# Altium schematic sheet power supply.SchDoc: Power Supply
size 292 x 203 mm; DrawnBy: DMGB Nawarathna; DocumentNumber: -; SheetNumber: 3; SheetTotal: 4; Project: Product Sorter; DateDrawn: 4/4/2024
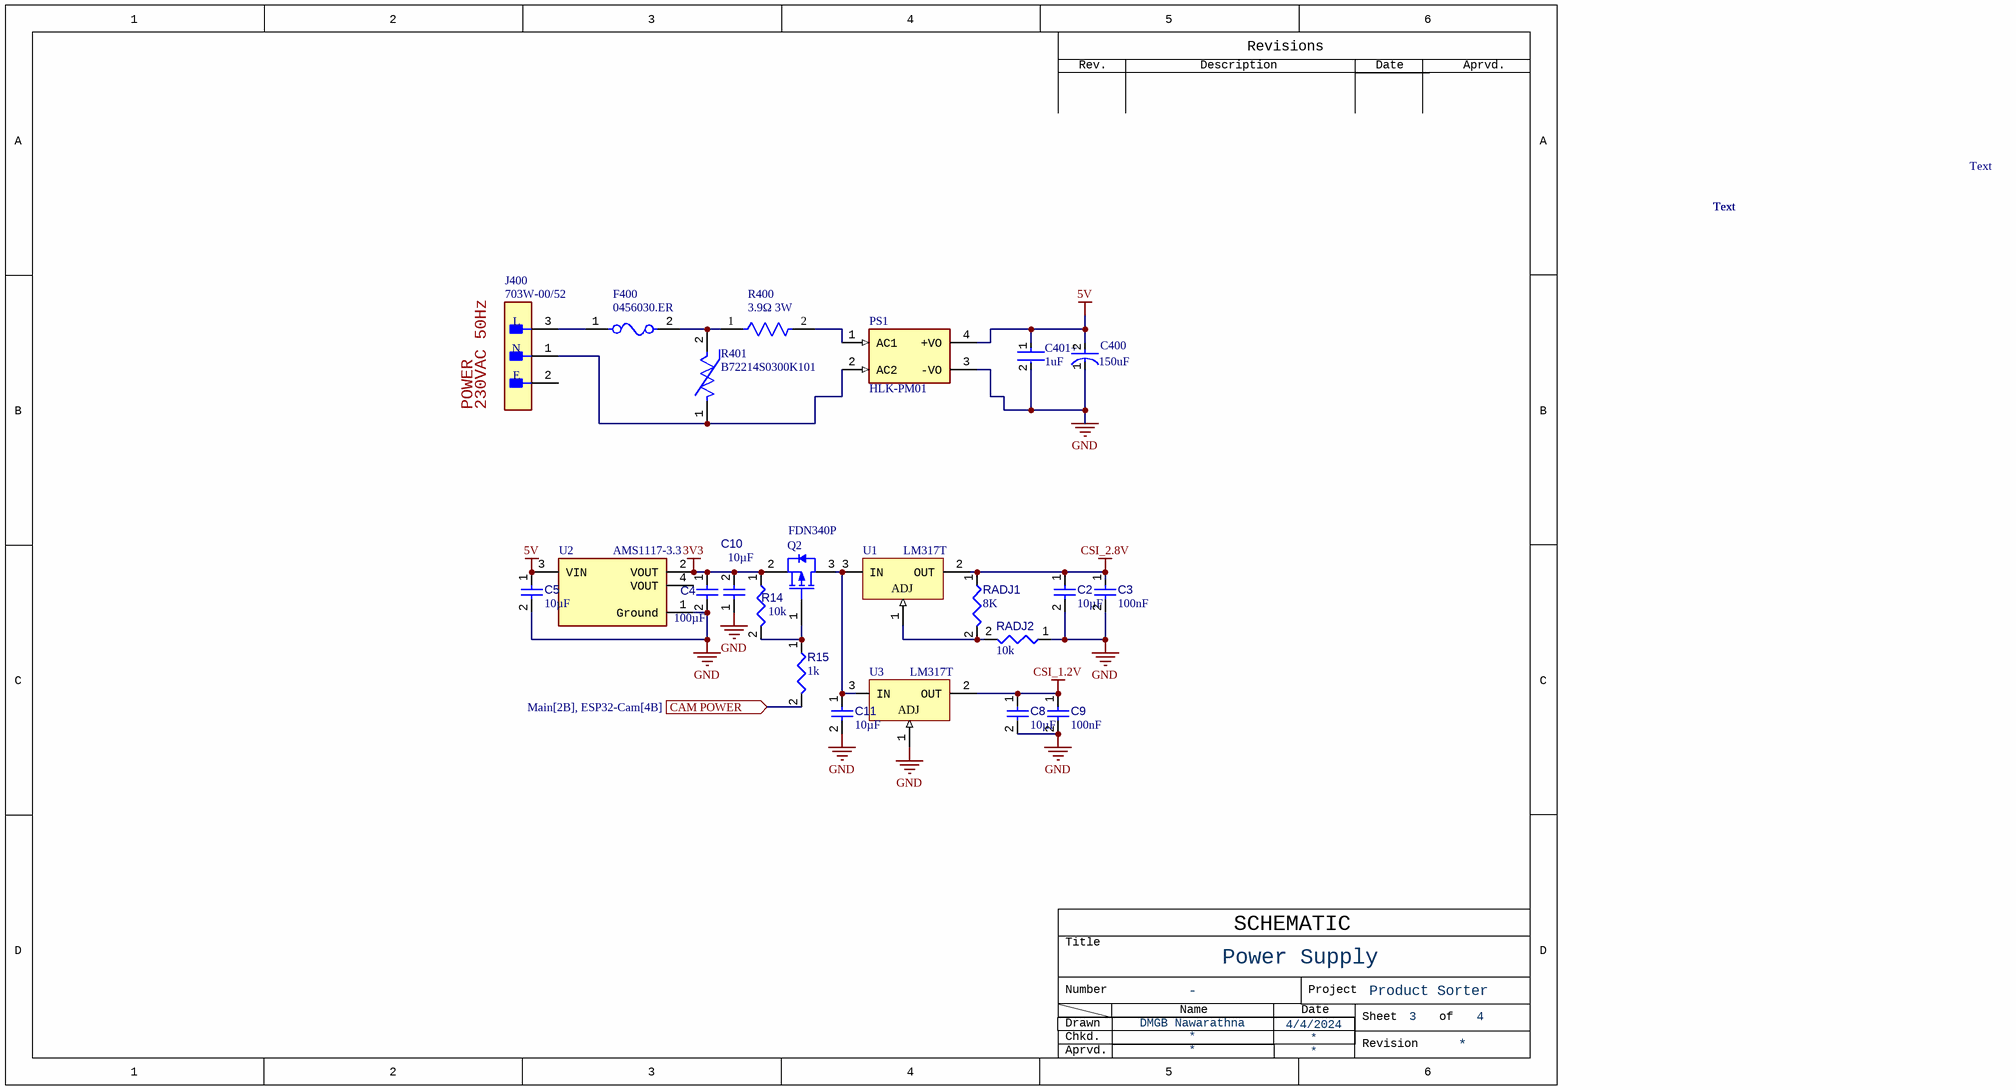
[diagram p0: power supply.SchDoc]

## Parts
C2  value 10µF  [CAPC0603(1608)100_L]  (hidden comment: Capacitor 10µF +/-20% 10V 0603)
C3  value 100nF  [CAPC1005X56X25LL10T15]  (hidden comment: Capacitor 0.1 uF +/- 5% 16 V 0402)
C4  value 100µF  [CAPC0805(2012)145_L]  (hidden comment: Capacitor 100µF +/-20% 6.3V 0805)
C5  value 10µF  [CAPC0603(1608)100_L]  (hidden comment: Capacitor 10µF +/-20% 10V 0603)
C8  value 10µF  [CAPC0603(1608)100_L]  (hidden comment: Capacitor 10µF +/-20% 10V 0603)
C9  value 100nF  [CAPC1005X56X25LL10T15]  (hidden comment: Capacitor 0.1 uF +/- 5% 16 V 0402)
C10  value 10µF  [CAPC0603(1608)100_L]  (hidden comment: Capacitor 10µF +/-20% 10V 0603)
C11  value 10µF  [CAPC0603(1608)100_L]  (hidden comment: Capacitor 10µF +/-20% 10V 0603)
C400  Capacitance: 150uF  [FP-FKD-MFG]  (hidden comment: EEE-FK1A151P)
C401  Capacitance: 1uF  [FP-1210-L_3_3_0_4-W_2_5_0-IPC_B]  (hidden comment: 12101C105KAZ2A)
F400  0456030.ER  [FP-0456-MFG]
J400  703W-00/52  [FP-703W-00-52-MFG]
PS1  HLK-PM01  [CONV_HLK-PM01]
Q2  FDN340P  [FAIR-SSOT3L-3_V]
R14  value 10k  [RESC2013X50X35ML15T15]  (hidden comment: Resistor 10k +/-1% 0805 125 mW)
R15  value 1k  [RESC0805(2012)_L]  (hidden comment: Resistor 1K +/-5% 0805 125 mW)
R400  Power Rating: 3W  Resistance: 3.9Ω  [FP-RWM0410-MFG]  (hidden comment: RWM04103R90JR15E1)
R401  B72214S0300K101  [FP-B72214S0300K101-MFG]
RADJ1  value 8K  [RESC0805(2012)_L]  (hidden comment: Resistor 1K +/-5% 0805 125 mW)
RADJ2  value 10k  [RESC2013X50X35ML15T15]  (hidden comment: Resistor 10k +/-1% 0805 125 mW)
U1  LM317T  [TO-220]
U2  AMS1117-3.3  [FP-AMS1117-IPC_C]
U3  LM317T  [TO-220]

## Ports
CAM POWER (in, see Main[2B], ESP32-Cam[4B])

## Nets
3V3: C4.1 C10.2 Q2.2(SOURCE) R14.1 U2.2(VOUT)
5V: C5.1 C400.2(A) C401.1 PS1.4(+VO) U2.3(VIN)
CSI_1.2V: C8.1 C9.1 U3.2(OUT)
CSI_2.8V: C2.1 C3.1 RADJ1.1 U1.2(OUT)
GND: C2.2 C3.2 C4.2 C5.2 C8.2 C9.2 C10.1 C11.2 C400.1(C) C401.2 PS1.3(-VO) RADJ2.1 U2.1(Ground) U3.1(ADJ)
CAM POWER: R15.2 ; port CAM POWER
NetC11_1: C11.1 Q2.3(DRAIN) U1.3(IN) U3.3(IN)
NetF400_1: F400.1 J400.3(L)
NetF400_2: F400.2 R400.1 R401.2
NetJ400_1: J400.1(N) PS1.2(AC2) R401.1
NetPS1_1: PS1.1(AC1) R400.2
NetQ2_1: Q2.1(GATE) R14.2 R15.1
NetRADJ1_2: RADJ1.2 RADJ2.2 U1.1(ADJ)

Not connected (* = marked no-connect by the designer): J400 2(E); U2 4(VOUT)

## Notes on the sheet
- Text
- POWER
- (near J400) 230VAC 50Hz
- Rev.
- Description
- Revisions
- Date
- Aprvd.
- Title
- SCHEMATIC
- Number
- Drawn
- Chkd.
- Name
- Project
- Sheet      of
- Revision
- (in symbol CMP-05427-002136-1) +

## Library data of the parts
C2 C5 C8 C10 C11 = CMP-001-00075-4: Chip Capacitor, 10µF +/-20%, 10V, 0603, Thickness 1 mm; Tolerance: 10%; Voltage Rating: 10V; Max Operating Temperature: 85°C; Pins: 2; Case/Package: 0603; Mounting Technology: SMT; Min Operating Temperature: -55°C
C3 C9 = CMP-001-00001-6: Chip Capacitor, 0.1 uF, +/- 5%, 16 V, 0402 (1005 Metric); Capacitor Type: Ceramic; Voltage Rating: 16V; Max Operating Temperature: 125°C; Min Operating Temperature: -55°C; Case/Package: 0402; Mounting Technology: SM; Pins: 2; Tolerance: 5%; RoHS Compliant: True
C4 = CMP-001-00054-4: Chip Capacitor, 100µF +/-20%, 6.3V, 0805, Thickness 1.45 mm; Tolerance: 10%; Min Operating Temperature: -55°C; Max Operating Temperature: 85°C; Pins: 2; Mounting Technology: SMT; Case/Package: 0805; Voltage Rating: 6.3V
C400 = CMP-05427-002136-1: CAP ALUM 150UF 20% 10V SMD; Impedance: 360mR; Ripple Current (AC): 240mA; Polarity: Polar; Life (Hours): 2000Hour; Leakage Current: 3uA; Lead Diameter: 0.65mm; Min Operating Temperature: -55°C; Lead Pitch: 1.8mm; Size: 5.8mm; Diameter: 6.3mm; Package Quantity: 1000; Number of Pins: 2; Termination: SMD/SMT; Mount: Surface Mount; Construction: Cylindrical; Series: FK; Case/Package: Radial; Lead Free: Lead Free; Voltage: 10V; Packaging: Tape and Reel; Height: 5.8mm; Max Operating Temperature: 105°C; Voltage Rating (DC): 10V; Reach SVHC Compliant: Yes; Width: 7.8mm; Tolerance: 20%; Contact Plating: Tin; Voltage Rating: 10V; Ratings: AEC-Q200; RoHS Compliant: Yes; Radiation Hardening: No; ESR (Equivalent Series Resistance): 360mR; Height - Seated (Max): 0.24inch; Length: 5.8mm; Ripple Current: 240mA
C401 = CMP-04427-007938-1: General Purpose Ceramic Capacitor, 1210, 1uF, 10%, X7R, 15%, 100V; Dissipation Factor: 2.5%; Package Quantity: 1; Contact Plating: Tin; Lead Free: Lead Free; Construction: Flat; Dielectric: X7R; Width: 2.5mm; Voltage Rating (DC): 100V; Case Code (Imperial): 1210; Case Code (Metric): 3225; Packaging: Tape and Reel; Min Operating Temperature: -55°C; Tolerance: 10%; Voltage: 100V; RoHS Compliant: Yes; Voltage Rating: 100V; Max Operating Temperature: 125°C; REACH SVHC: No SVHC; Features: Soft Termination; Height: 2.79mm; Termination: SMD/SMT; Thickness: 0.11inch; Case/Package: 1210; Length: 3.2mm; Series: FLEXITERM®; Dielectric Material: Ceramic; Mount: Surface Mount; Radiation Hardening: No; Depth: 2.5mm
F400 = CMP-2000-05709-2: FUSE BOARD MNT 30A 125VAC 72VDC; Manufacturer: Littelfuse; Fuse Interrupt Ac Current: 300A; Fuse Blow Speed: Fast; Voltage Rating: 125V; Max Fuse Dc Voltage: 72V; Fuse Interrupt Dc Current: 1000A; Resistance: 0.00132Ω; Value: 0.00132Ω; Fuse I2T: 81A2Sec; Fuse Voltage Drop: 69.9mV; Package: 0456; Digikey Description: FUSE BOARD MNT 30A 125VAC 72VDC; Mouser Description: 456 Series Fast-Acting 125 V 30 A 10.10 x 3.05 mm NANO2® SMT Ceramic Fuse; Height: 3.05mm; Temperature: -55°C to +125°C; Fuse Current: 30A; Octopart: https://octopart.com/0456030.er-littelfuse-7502597; Ipc Land Pattern Name: CAPC1008305X305; Device Class L3: unset; ComponentLink2URL: https://www.littelfuse.com/~/media/electronics/datasheets/fuses/littelfuse_fuse_456_datasheet.pdf.pdf; Automotive: No; Lead Free: Yes; Device Class L1: Circuit Protection; Temperature Range Low: -55°C; Category: Fuse; Max Fuse Ac Voltage: 125V; Temperature Range High: +125°C; RoHS: TRUE; ComponentLink2Description: Datasheet; Device Class L2: Fuses; Manufacturer Part Number: 0456030.ER
J400 = CMP-64678-000001-1: PWR ENT RCPT IEC320-C14 PNL SLDR; Max Voltage Rating (AC): 250V; Approvals: UL; Current Rating: 15A; Number of Poles: 2; Fuse: No; Number of Positions: 3; Gender: Receptacle; Panel Thickness: 0.12inch; Pitch: 7mm; Voltage Rating (AC): 250V; Orientation: Right Angle; Contact Plating: Tin; Mount: Through Hole; Housing Material: Thermoplastic; Current: 15A; Termination: Solder; REACH SVHC: No SVHC; Lead Free: Lead Free; Voltage Rating: 250V; Number of Contacts: 3; Color: Black; Connector Type: Receptacle; Packaging: Bulk; Max Current Rating: 15A; Voltage Rating (DC): 250V; Package Quantity: 100
PS1 = HLK-PM01: The HLK-PM01 is a small size low cost AC to DC converter which can take in 110V/220V AC at 50/60 Hz and give 5V 3W output. The module is can be used in designs which run on 5V and needs to be powered form the AC mains.; MF: Hi-link; Package: None; Price: None; Value: *; SnapEDA_Link: https://www.snapeda.com/parts/hlk-pm01/Hi-link/view-part/?ref=snap; MP: hlk-pm01; Availability: Not in stock; Check_prices: https://www.snapeda.com/parts/hlk-pm01/Hi-link/view-part/?ref=eda
Q2 = CMP-013-00016-4: Single P-Channel, Logic Level, PowerTrench(R) MOSFET, 2 A, 20 V, -55 to 150 degC, 3-Pin SOT-23, RoHS, Tape and Reel; Manufacturer: Fairchild Semiconductor; Package Version: Rev. 3, 05/2015; Nominal Vgs: -800mV; Power: 500mW; Nominal Dual Supply Voltage: -20V; Typical Rise Time: 9ns; Elements: 1; Rds On Max: 70mohm; Input Capacitance: 779pF; Package Reference: SSOT3L; Min Operating Temperature: -55°C; RoHS Compliant: True; Package Description: 3-Pin Small Outline Transistor, Body 2.92 x 1.4 mm, Pitch 0.95 mm; Pins: 3; Datasheet Version: Rev. E1, 02/2007; Mounting Technology: SM; Package Quantity: 3000; Packaging: TapeandReel; Max Operating Temperature: 150°C; Datasheet URL: https://www.fairchildsemi.com/datasheets/FD/FDN340P.pdf; Case/Package: TO-236-3
R14 RADJ2 = CMP-009-00018-5: Chip Resistor, 10 KOhm, +/- 1%, 125 mW, -55 to 155 degC, 0805 (2012 Metric); Power: 125mW; Voltage Rating: 150V; Tolerance: 1%; Pins: 2; Min Operating Temperature: -55°C; Case/Package: 0805; Max Operating Temperature: 155°C; RoHS Compliant: True; Mounting Technology: SM
R15 RADJ1 = CMP-009-00118-3: Chip Resistor, 1 kOhms, +/-5%, 125 mW, -55 to 155 degC, 0805; Tolerance: 5%; Power: 125mW; Case/Package: 0805; Pins: 2; Min Operating Temperature: -55°C; Max Operating Temperature: 155°C
R400 = CMP-00030-42636952-1: RWM04103R90JR15E1 Resistor; Wirewound; Res 3.9 Ohms; Pwr-Rtg 3 W; Tol 5%; Axial; Vitreous Enamel; Lead Diameter: 800µm; Voltage Rating: 120V; Temperature Coefficient: 75ppm/°C; REACH SVHC: No SVHC; Military Standard: Not; Tolerance: 5%; Min Operating Temperature: -55°C; Case/Package: Axial; Voltage Rating (AC): 120V; Diameter: 5.5mm; Termination: Axial; Length: 12mm; Width: 5.5mm; Mount: Through Hole; Max Operating Temperature: 350°C; NexarPartId: 42636952; Max Power Dissipation: 3W; Contact Plating: Copper, Silver, Tin; Height: 6.5mm; RoHS: Compliant; Number of Terminations: 2; Voltage Rating (DC): 120V; Composition: Wirewound; Radiation Hardening: No
R401 = CMP-10618-000011-1: VARISTOR 47V 1KA DISC 14MM; Manufacturer: EPCOS; Clamping Current: 10A; Clamping Voltage: 93V; Voltage Tolerance: 10%; Voltage Rating Dc: 38V; Voltage Rating Ac: 30V; Value: 4950pF; Digikey Description: VARISTOR 47V 1KA DISC 14MM; ComponentLink2Description: Datasheet; Temperature: -40°C to +105°C; Category: Res; Device Class L1: Circuit Protection; Octopart: https://octopart.com/b72214s0300k101-epcos-11931390; Package: 0; Mouser Description: Varistors 30volts 1000A; Temperature Range Low: -40°C; Manufacturer Part Number: B72214S0300K101; Device Class L2: Varistors; Height: 18.5mm; Varistor Voltage: 47V; Device Class L3: unset; RoHS: TRUE; Temperature Range High: +105°C; ComponentLink2URL: https://www.tdk-electronics.tdk.com/inf/70/db/var/SIOV_Leaded_StandarD.pdf; Lead Free: Yes; Capacitance: 4950pF; Automotive: No
U1 U3 = CMP-0244-00444-1: 1.5A, 1.2V to 37V Adjustable Voltage Regulator, 3-Pin TO-220; PackageVersion: 2011; ComponentLink1URL: http://www.st.com; ComponentLink2URL: http://www.st.com/internet/com/TECHNICAL_RESOURCES/TECHNICAL_LITERATURE/DATASHEET/CD00000455.pdf; PackageDescription: TO, Thru-Hole, Vertical, Heatsink Mounted; 3 In-Line Leads; Pitch 2.54 mm; PackageReference: TO-220; ComponentLink1Description: Manufacturer URL; ComponentLink3URL: http://www.st.com/internet/com/TECHNICAL_RESOURCES/TECHNICAL_LITERATURE/PACKAGE_INFORMATION/CD00004649.pdf; DatasheetVersion: 1/11/2011; ComponentLink2Description: Datasheet; ComponentLink3Description: Package Specification
U2 = CMP-209535-000001-1: LDO Voltage Regulators 1A, 3.3V; Manufacturer: Advanced Monolithic Systems; Dropout Voltage: 1.1V; Output Type: Fixed; Nominal Supply Current: 5mA; Max Power Dissipation: 1.2W; Max Supply Voltage: 15V; Number Of Outputs: 1; Standoff Height: 0.64mm; Max Junction Temp: +125°C; Height: 1.8mm; Package: AMS1117; Device Class L2: Power Management ICs; ComponentLink2Description: Datasheet; ComponentLink2URL: http://www.advanced-monolithic.com/pdf/ds1117.pdf; Category: IC; RoHS: TRUE; Automotive: No; Device Class L1: Integrated Circuits (ICs); Output Current: 1A; Device Class L3: Voltage Regulators - Linear; Temperature: -40°C to +125°C; Output Voltage: 3.3V; Manufacturer Part Number: AMS1117-3.3; Temperature Range Low: -40°C; Octopart: https://octopart.com/ams1117-3.3-advanced+monolithic+systems-25899300; Lead Free: Yes; Ipc Land Pattern Name: SOT229P700X180-4; Temperature Range High: +125°C